# Altium schematic sheet keyboard-Right.SchDoc
size 420 x 297 mm; SheetNumber: 8; SheetTotal: 11; SPICEModelCacheCUGXHSME: <root> / <DocumentId>CUGXHSME</DocumentId> / <CacheFrame Number="0"> / <Model Name="0603_885012206020_100nf" Kind="CKT"> / <Text>******* / .subckt 0603_885012206020_100nF 1 2 / Rser 1 3 0.0188883213835 / Lser 2 4 4.53593763E-10 / C1 3 4 0.0000001 / Rpar 3 4 5000000000 / .ends 0603_885012206020_100nF</Text> / </Model> / </CacheFrame> / </root>
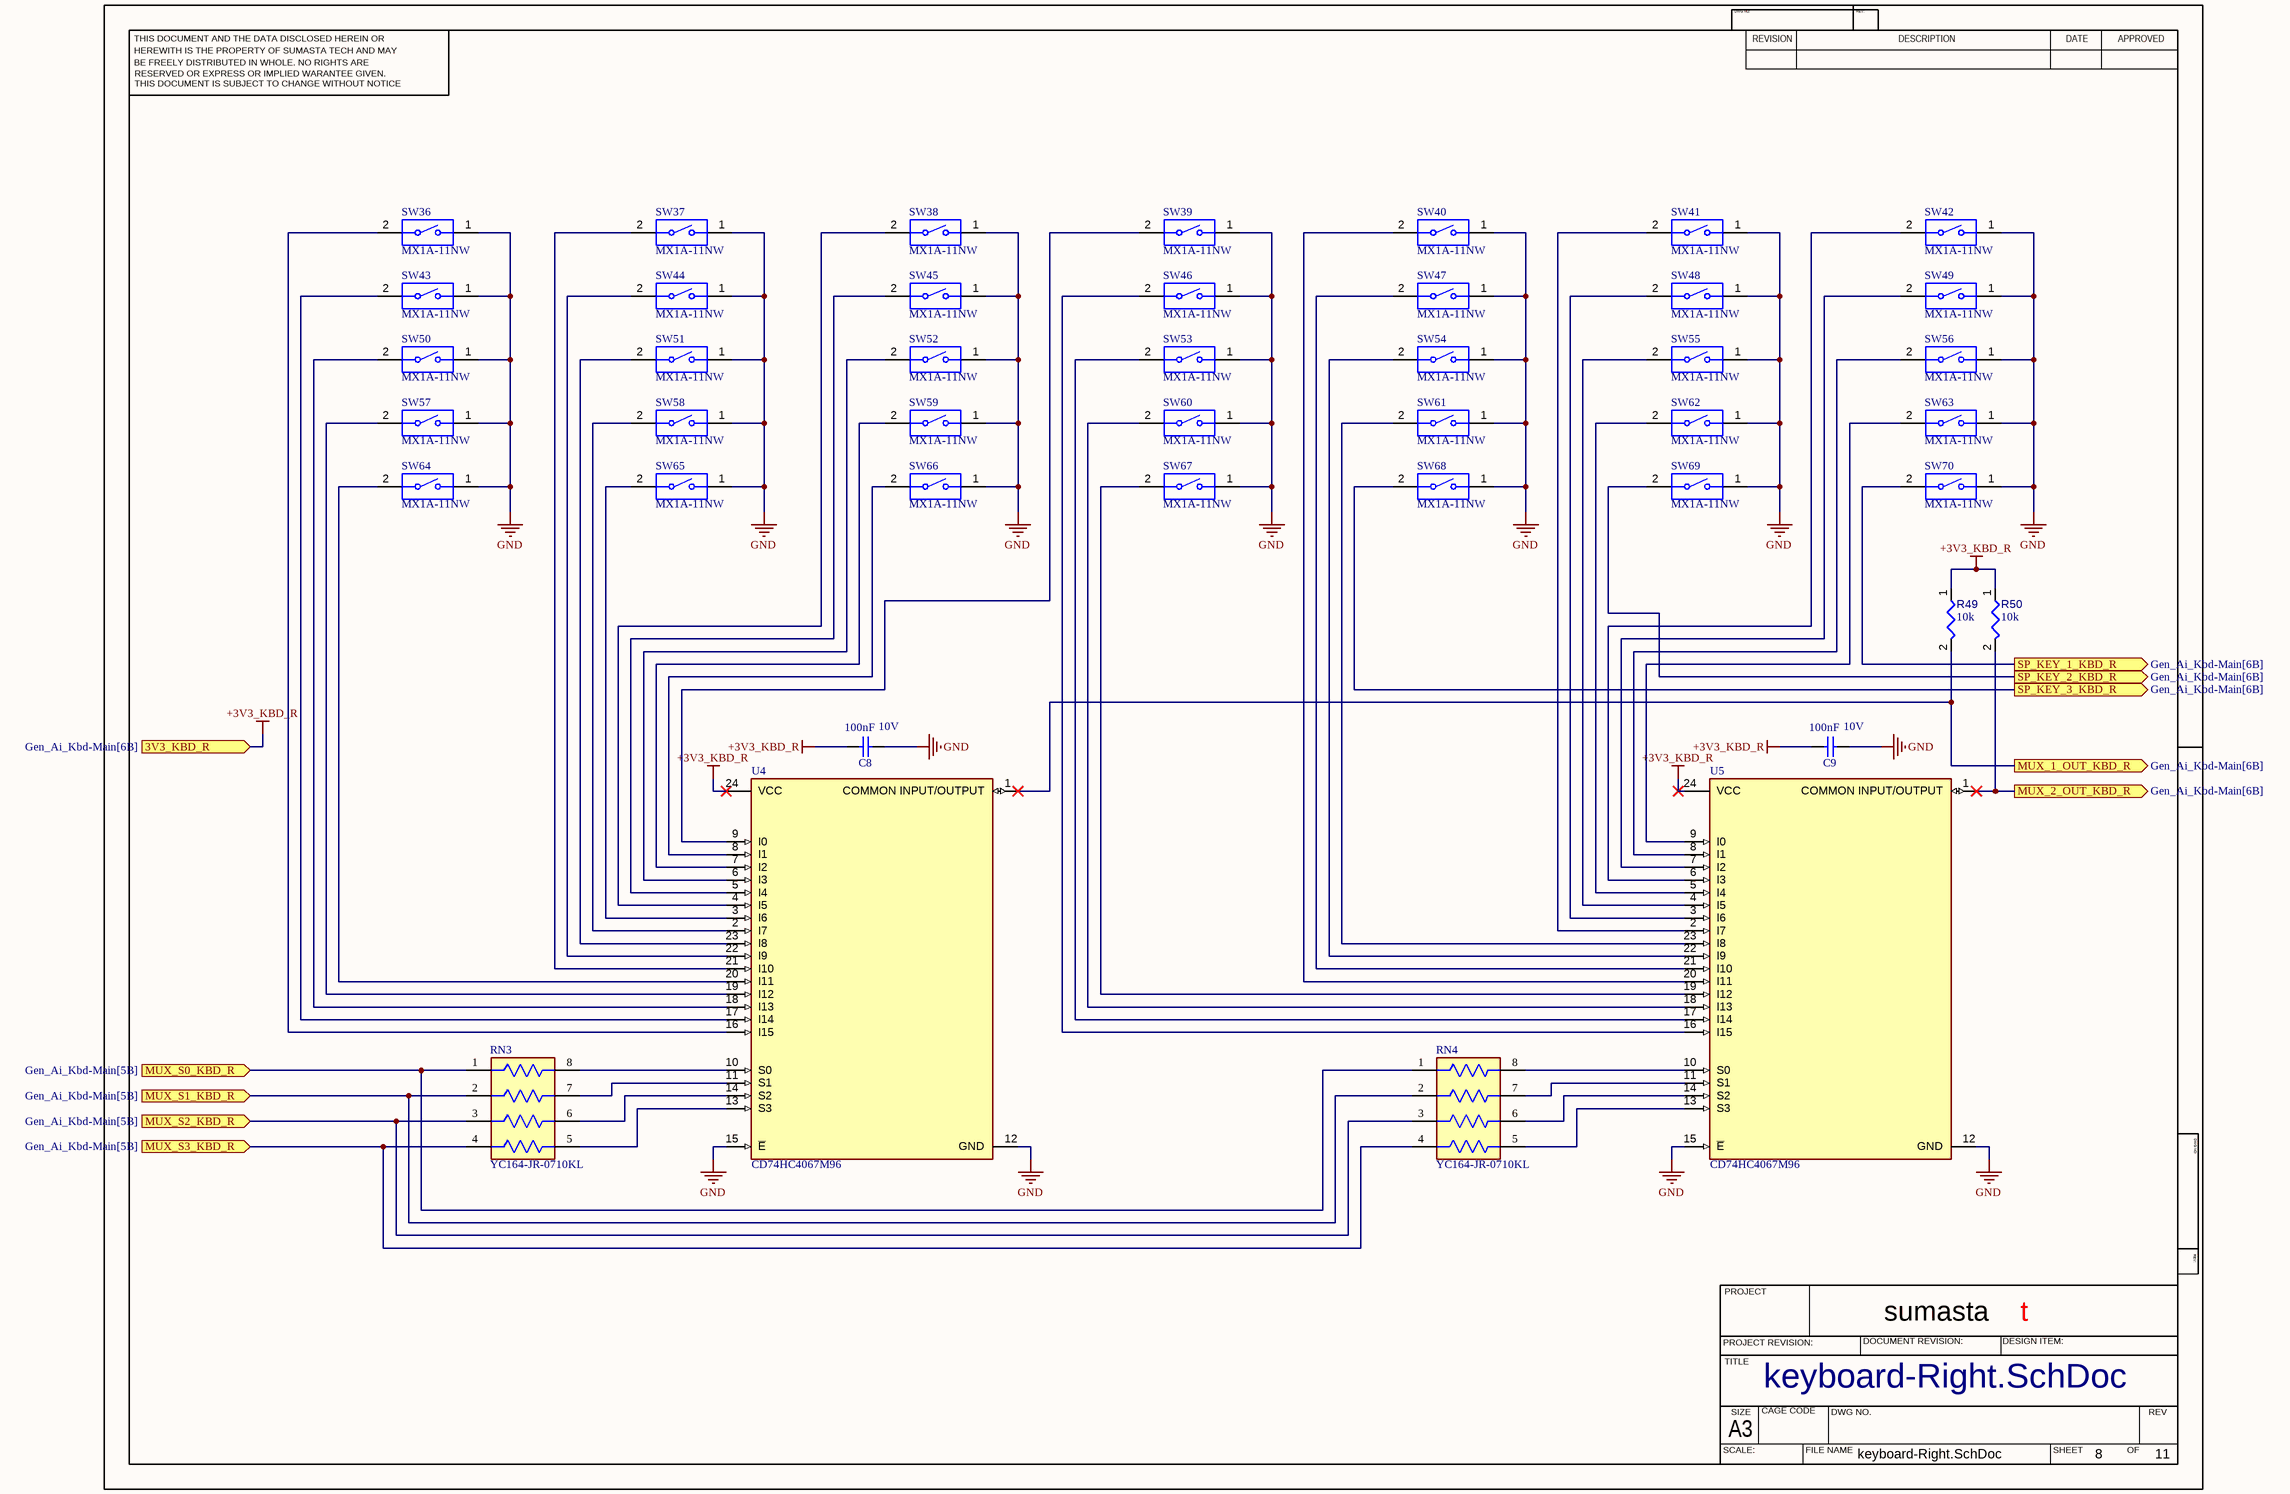
[diagram p0: keyboard-Right.SchDoc]

## Parts
C8  Rated Voltage (DC): 10V  Capacitance: 100nF  [WCAP-CSGP_0603_L1.6W0.8H0.8_Reflow]  (hidden comment: 885012206020)
C9  Rated Voltage (DC): 10V  Capacitance: 100nF  [WCAP-CSGP_0603_L1.6W0.8H0.8_Reflow]  (hidden comment: 885012206020)
R49  value 10k  [RESC1608X55X25ML10T15]  (hidden comment: Resistor 10k +/-1% 0603 100 mW)
R50  value 10k  [RESC1608X55X25ML10T15]  (hidden comment: Resistor 10k +/-1% 0603 100 mW)
RN3  YC164-JR-0710KL  [FP-YC164-MFG]
RN4  YC164-JR-0710KL  [FP-YC164-MFG]
SW36  MX1A-11NW  [CHRY-MX1A-11NW_V]
SW37  MX1A-11NW  [CHRY-MX1A-11NW_V]
SW38  MX1A-11NW  [CHRY-MX1A-11NW_V]
SW39  MX1A-11NW  [CHRY-MX1A-11NW_V]
SW40  MX1A-11NW  [CHRY-MX1A-11NW_V]
SW41  MX1A-11NW  [CHRY-MX1A-11NW_V]
SW42  MX1A-11NW  [CHRY-MX1A-11NW_V]
SW43  MX1A-11NW  [CHRY-MX1A-11NW_V]
SW44  MX1A-11NW  [CHRY-MX1A-11NW_V]
SW45  MX1A-11NW  [CHRY-MX1A-11NW_V]
SW46  MX1A-11NW  [CHRY-MX1A-11NW_V]
SW47  MX1A-11NW  [CHRY-MX1A-11NW_V]
SW48  MX1A-11NW  [CHRY-MX1A-11NW_V]
SW49  MX1A-11NW  [CHRY-MX1A-11NW_V]
SW50  MX1A-11NW  [CHRY-MX1A-11NW_V]
SW51  MX1A-11NW  [CHRY-MX1A-11NW_V]
SW52  MX1A-11NW  [CHRY-MX1A-11NW_V]
SW53  MX1A-11NW  [CHRY-MX1A-11NW_V]
SW54  MX1A-11NW  [CHRY-MX1A-11NW_V]
SW55  MX1A-11NW  [CHRY-MX1A-11NW_V]
SW56  MX1A-11NW  [CHRY-MX1A-11NW_V]
SW57  MX1A-11NW  [CHRY-MX1A-11NW_V]
SW58  MX1A-11NW  [CHRY-MX1A-11NW_V]
SW59  MX1A-11NW  [CHRY-MX1A-11NW_V]
SW60  MX1A-11NW  [CHRY-MX1A-11NW_V]
SW61  MX1A-11NW  [CHRY-MX1A-11NW_V]
SW62  MX1A-11NW  [CHRY-MX1A-11NW_V]
SW63  MX1A-11NW  [CHRY-MX1A-11NW_V]
SW64  MX1A-11NW  [CHRY-MX1A-11NW_V]
SW65  MX1A-11NW  [CHRY-MX1A-11NW_V]
SW66  MX1A-11NW  [CHRY-MX1A-11NW_V]
SW67  MX1A-11NW  [CHRY-MX1A-11NW_V]
SW68  MX1A-11NW  [CHRY-MX1A-11NW_V]
SW69  MX1A-11NW  [CHRY-MX1A-11NW_V]
SW70  MX1A-11NW  [CHRY-MX1A-11NW_V]
U4  CD74HC4067M96  [FP-DW0024A-MFG]
U5  CD74HC4067M96  [FP-DW0024A-MFG]

## Ports
3V3_KBD_R (in, see Gen_Ai_Kbd-Main[6B]), MUX_1_OUT_KBD_R (out, see Gen_Ai_Kbd-Main[6B]), MUX_2_OUT_KBD_R (out, see Gen_Ai_Kbd-Main[6B]), MUX_S0_KBD_R (in, see Gen_Ai_Kbd-Main[5B]), MUX_S1_KBD_R (in, see Gen_Ai_Kbd-Main[5B]), MUX_S2_KBD_R (in, see Gen_Ai_Kbd-Main[5B]), MUX_S3_KBD_R (in, see Gen_Ai_Kbd-Main[5B]), SP_KEY_1_KBD_R (out, see Gen_Ai_Kbd-Main[6B]), SP_KEY_2_KBD_R (out, see Gen_Ai_Kbd-Main[6B]), SP_KEY_3_KBD_R (out, see Gen_Ai_Kbd-Main[6B])

## Nets
+3V3_KBD_R: C8.1 C9.1 R49.1 R50.1 U4.24(VCC) U5.24(VCC) ; port 3V3_KBD_R
GND: C8.2 C9.2 SW36.1 SW37.1 SW38.1 SW39.1 SW40.1 SW41.1 SW42.1 SW43.1 SW44.1 SW45.1 SW46.1 SW47.1 SW48.1 SW49.1 SW50.1 SW51.1 SW52.1 SW53.1 SW54.1 SW55.1 SW56.1 SW57.1 SW58.1 SW59.1 SW60.1 SW61.1 SW62.1 SW63.1 SW64.1 SW65.1 SW66.1 SW67.1 SW68.1 SW69.1 SW70.1 U4.12(GND) U4.15(~{E}) U5.12(GND) U5.15(~{E})
MUX_1_OUT_KBD_R: R49.2 U4.1(COMMON_INPUT/OUTPUT) ; port MUX_1_OUT_KBD_R
MUX_2_OUT_KBD_R: R50.2 U5.1(COMMON_INPUT/OUTPUT) ; port MUX_2_OUT_KBD_R
MUX_S0_KBD_R: RN3.1 RN4.1 ; port MUX_S0_KBD_R
MUX_S1_KBD_R: RN3.2 RN4.2 ; port MUX_S1_KBD_R
MUX_S2_KBD_R: RN3.3 RN4.3 ; port MUX_S2_KBD_R
MUX_S3_KBD_R: RN3.4 RN4.4 ; port MUX_S3_KBD_R
SP_KEY_1_KBD_R: SW70.2 ; port SP_KEY_1_KBD_R
SP_KEY_2_KBD_R: SW69.2 ; port SP_KEY_2_KBD_R
SP_KEY_3_KBD_R: SW68.2 ; port SP_KEY_3_KBD_R
NetRN3_5: RN3.5 U4.13(S3)
NetRN3_6: RN3.6 U4.14(S2)
NetRN3_7: RN3.7 U4.11(S1)
NetRN3_8: RN3.8 U4.10(S0)
NetRN4_5: RN4.5 U5.13(S3)
NetRN4_6: RN4.6 U5.14(S2)
NetRN4_7: RN4.7 U5.11(S1)
NetRN4_8: RN4.8 U5.10(S0)
NetSW36_2: SW36.2 U4.16(I15)
NetSW37_2: SW37.2 U4.21(I10)
NetSW38_2: SW38.2 U4.4(I5)
NetSW39_2: SW39.2 U4.9(I0)
NetSW40_2: SW40.2 U5.20(I11)
NetSW41_2: SW41.2 U5.2(I7)
NetSW42_2: SW42.2 U5.6(I3)
NetSW43_2: SW43.2 U4.17(I14)
NetSW44_2: SW44.2 U4.22(I9)
NetSW45_2: SW45.2 U4.5(I4)
NetSW46_2: SW46.2 U5.16(I15)
NetSW47_2: SW47.2 U5.21(I10)
NetSW48_2: SW48.2 U5.3(I6)
NetSW49_2: SW49.2 U5.7(I2)
NetSW50_2: SW50.2 U4.18(I13)
NetSW51_2: SW51.2 U4.23(I8)
NetSW52_2: SW52.2 U4.6(I3)
NetSW53_2: SW53.2 U5.17(I14)
NetSW54_2: SW54.2 U5.22(I9)
NetSW55_2: SW55.2 U5.4(I5)
NetSW56_2: SW56.2 U5.8(I1)
NetSW57_2: SW57.2 U4.19(I12)
NetSW58_2: SW58.2 U4.2(I7)
NetSW59_2: SW59.2 U4.7(I2)
NetSW60_2: SW60.2 U5.18(I13)
NetSW61_2: SW61.2 U5.23(I8)
NetSW62_2: SW62.2 U5.5(I4)
NetSW63_2: SW63.2 U5.9(I0)
NetSW64_2: SW64.2 U4.20(I11)
NetSW65_2: SW65.2 U4.3(I6)
NetSW66_2: SW66.2 U4.8(I1)
NetSW67_2: SW67.2 U5.19(I12)

## Notes on the sheet
- THIS DOCUMENT AND THE DATA DISCLOSED HEREIN OR
- HEREWITH IS THE PROPERTY OF SUMASTA TECH AND MAY
- DWG NO:
- REVISION
- REV:
- DESCRIPTION
- DATE
- APPROVED
- BE FREELY DISTRIBUTED IN WHOLE. NO RIGHTS ARE
- THIS DOCUMENT IS SUBJECT TO CHANGE WITHOUT NOTICE
- RESERVED OR EXPRESS OR IMPLIED WARANTEE GIVEN.
- PROJECT
- sumasta
- t
- PROJECT REVISION:
- TITLE
- DOCUMENT REVISION:
- DESIGN ITEM:
- SCALE:
- A3
- SIZE
- CAGE CODE
- FILE NAME
- DWG NO.
- SHEET
- OF
- REV

## Library data of the parts
C8 C9 = CMP-007-000576-1: WCAP-CSGP Multilayer Ceramic Chip Capacitor, General Purpose, size 0603, X7R, 100nF, 10VDC; Manufacturer: Wurth Elektronik; Case/Size Code: 0603; Capacitance Tolerance: +/-10%; Technical Reference: X7R0603104K010DFCT10000; Insulation Resistance: 5GO; Dissipation Factor: 5%; Operating Temperature Min: -55°C; Packaging: Tape and Reel; Manufacturer Part Number: 885012206020; Source: WCAP-CSGP.SchLib; ComponentLink1Description: Website Link; Ceramic Type: X7R; Component Type: Standard; Height: 0.8mm; ComponentLink2URL: https://www.we-online.com/redexpert/spec/885012206020?ad; Mount: Surface Mount; Length: 1.6mm; Pin Count: 2; Design Item ID: 885012206020; ComponentLink1URL: https://www.we-online.com/redexpert/article/885012206020?ad; Width: 0.8mm; Operating Temperature Max: 125°C; Category: Multilayer Ceramic Chip Capacitors; Match Code: WCAP-CSGP; ComponentLink2Description: Datasheet Link
R49 R50 = CMP-009-00017-5: Chip Resistor, 10 KOhm, +/- 1%, 01 W, -55 to 155 degC, 0603 (1608 Metric); Voltage Rating: 50V; Power: 100mW; RoHS Compliant: True; Min Operating Temperature: -55°C; Pins: 2; Case/Package: 0603; Mounting Technology: SM; Max Operating Temperature: 155°C; Tolerance: 1%
RN3 RN4 = CMP-03411-000003-1: RES ARRAY 4 RES 10K OHM 1206; Resistance Tolerance: 5%; Power Per Element: 62.5mW; Number of Circuits: 4; Number of Terminals/Pins: 8; Voltage Rating: 50V; Resistance: 10kR; Circuit Type: Isolated; Tolerance: 1%; Temperature Coefficient: 200ppm/°C; Depth: 1.6mm; Termination: SMD/SMT; Technology: THICK FILM; Lead Free: Lead Free; Min Operating Temperature: -55°C; Number of Elements: 4; Series: YC164; Radiation Hardening: No; Length: 0.126inch; Width: 0.063inch; Case Code (Metric): 3216; Number of Pins: 8; Package Quantity: 5000; Number of Contacts: 8; Working Voltage: 50V; Packaging: Tape and Reel; Height: 0.028inch; Mount: Surface Mount; Number of Resistors: 4; Case Code (Imperial): 1206; Size Code: 0603; Terminal Pitch: 0.8mm; Military Standard: Not; Power Dissipation: 62.5mW; Case/Package: 0164; RoHS Compliant: Yes; Max Operating Temperature: 155°C
SW36-SW70 = CMP-011-00013-1: Switch Key N.O. SPST 0.01A 12VAC 12VDC 0.58N PC Pins 50000000Cycles Thru-Hole
U4 U5 = CMP-04901-000007-1: IC MUX/DEMUX 1X16 24SOIC; Manufacturer: Texas Instruments; Standoff Height: 0.1mm; Logic Function Desc: Non-Inverting; Max Supply Voltage: 6V; Number Of Inputs: 16; Quiescent Current: 8uA; Number Of Circuits: 1; Propagation Delay: 6ns; Max Junction Temp: +150°C; Min Supply Voltage: 2V; ComponentLink2Description: Datasheet; Octopart: https://octopart.com/cd74hc4067m96-texas+instruments-722802; Ambient Temperature Range High: +125°C; Ipc Land Pattern Name: SOIC127P1030X265-24; Height: 2.65mm; Mouser Description: Multiplexer Switch ICs Hi-Spd CMOS 16Ch Anl Mltplxr/Demltplxr; Temperature Range Low: -55°C; Package: DW0024A; Temperature Range High: +125°C; Lead Free: Yes; ComponentLink2URL: http://www.ti.com/lit/ds/symlink/cd74hc4067.pdf; Manufacturer Part Number: CD74HC4067M96; RoHS: TRUE; Automotive: No; Device Class L1: Integrated Circuits (ICs); Digikey Description: IC MUX/DEMUX 1X16 24SOIC; Device Class L2: Logic ICs; Temperature: -55°C to +125°C; Device Class L3: Multiplexers; Category: IC; Ambient Temperature Range Low: -55°C; Number Of Outputs: 1